# EAGLE design extension_board (EAGLE 6.5.0)

## Sheet 1 of 5: Header
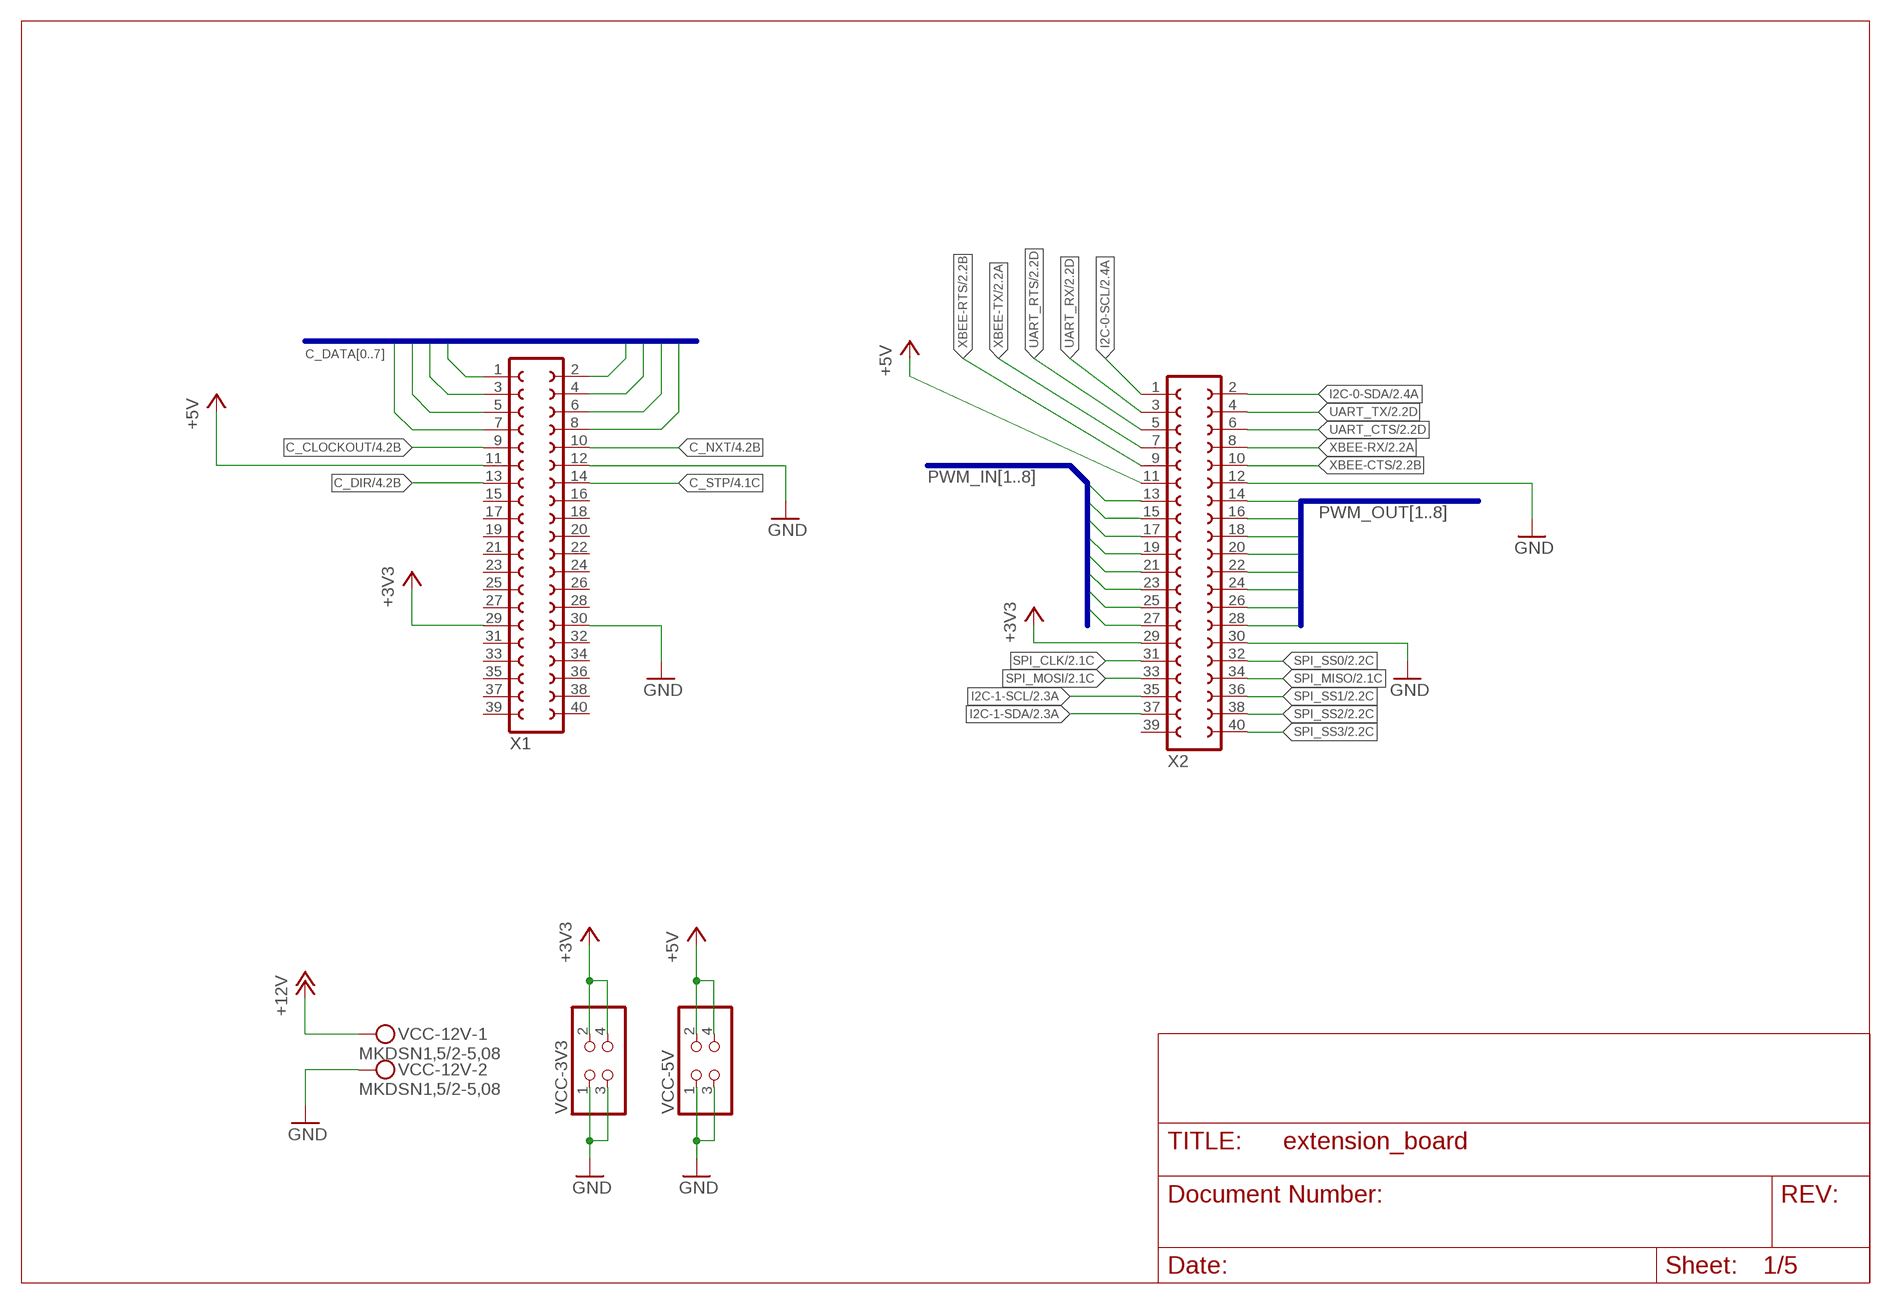
[diagram p0: schematic, sheet 1]

### Parts
VCC-3V3  PINHD-2X2  [2X02]
VCC-5V  PINHD-2X2  [2X02]
VCC-12V  MKDSN1,5/2-5,08  [MKDSN1,5/2-5,08]
X1  FE20-2  [FE20-2]
X2  FE20-2  [FE20-2]

### Nets
+3V3: VCC-3V3.2 VCC-3V3.4 X1.29 X2.29 ; also sheet 2,4,5
+5V: VCC-5V.2 VCC-5V.4 X1.11 X2.11 ; also sheet 2
+12V: VCC-12V.1 ; also sheet 3
C_CLOCKOUT: X1.9 ; also sheet 4
C_DATA0: X1.1 ; also sheet 4
C_DATA1: X1.3 ; also sheet 4
C_DATA2: X1.5 ; also sheet 4
C_DATA3: X1.7 ; also sheet 4
C_DATA4: X1.2 ; also sheet 4
C_DATA5: X1.4 ; also sheet 4
C_DATA6: X1.6 ; also sheet 4
C_DATA7: X1.8 ; also sheet 4
C_DIR: X1.13 ; also sheet 4
C_NXT: X1.10 ; also sheet 4
C_STP: X1.14 ; also sheet 4
GND: VCC-3V3.1 VCC-3V3.3 VCC-5V.1 VCC-5V.3 VCC-12V.2 X1.12 X1.30 X2.12 X2.30 ; also sheet 2,3,4,5
I2C-0-SCL: X2.1 ; also sheet 2
I2C-0-SDA: X2.2 ; also sheet 2
I2C-1-SCL: X2.35 ; also sheet 2
I2C-1-SDA: X2.37 ; also sheet 2
PWM_INPUT1: X2.13 ; also sheet 2
PWM_INPUT2: X2.15 ; also sheet 2
PWM_INPUT3: X2.17 ; also sheet 2
PWM_INPUT4: X2.19 ; also sheet 2
PWM_INPUT5: X2.21 ; also sheet 2
PWM_INPUT6: X2.23 ; also sheet 2
PWM_INPUT7: X2.25 ; also sheet 2
PWM_INPUT8: X2.27 ; also sheet 2
PWM_OUTPUT1: X2.28 ; also sheet 2
PWM_OUTPUT2: X2.26 ; also sheet 2
PWM_OUTPUT3: X2.24 ; also sheet 2
PWM_OUTPUT4: X2.22 ; also sheet 2
PWM_OUTPUT5: X2.20 ; also sheet 2
PWM_OUTPUT6: X2.18 ; also sheet 2
PWM_OUTPUT7: X2.16 ; also sheet 2
PWM_OUTPUT8: X2.14 ; also sheet 2
SPI_CLK: X2.31 ; also sheet 2
SPI_MISO: X2.34 ; also sheet 2
SPI_MOSI: X2.33 ; also sheet 2
SPI_SS0: X2.32 ; also sheet 2
SPI_SS1: X2.36 ; also sheet 2
SPI_SS2: X2.38 ; also sheet 2
SPI_SS3: X2.40 ; also sheet 2
UART_CTS: X2.6 ; also sheet 2
UART_RTS: X2.5 ; also sheet 2
UART_RX: X2.3 ; also sheet 2
UART_TX: X2.4 ; also sheet 2
XBEE-CTS: X2.10 ; also sheet 2
XBEE-RTS: X2.9 ; also sheet 2
XBEE-RX: X2.8 ; also sheet 2
XBEE-TX: X2.7 ; also sheet 2
Unconnected: X1.15 X1.16 X1.17 X1.18 X1.19 X1.20 X1.21 X1.22 X1.23 X1.24 X1.25 X1.26 X1.27 X1.28 X1.31 X1.32 X1.33 X1.34 X1.35 X1.36 X1.37 X1.38 X1.39 X1.40 X2.39

### Buses
PWM_IN[1..8]
PWM_OUT[1..8]
C_DATA[0..7]

## Sheet 2 of 5: Interfaces
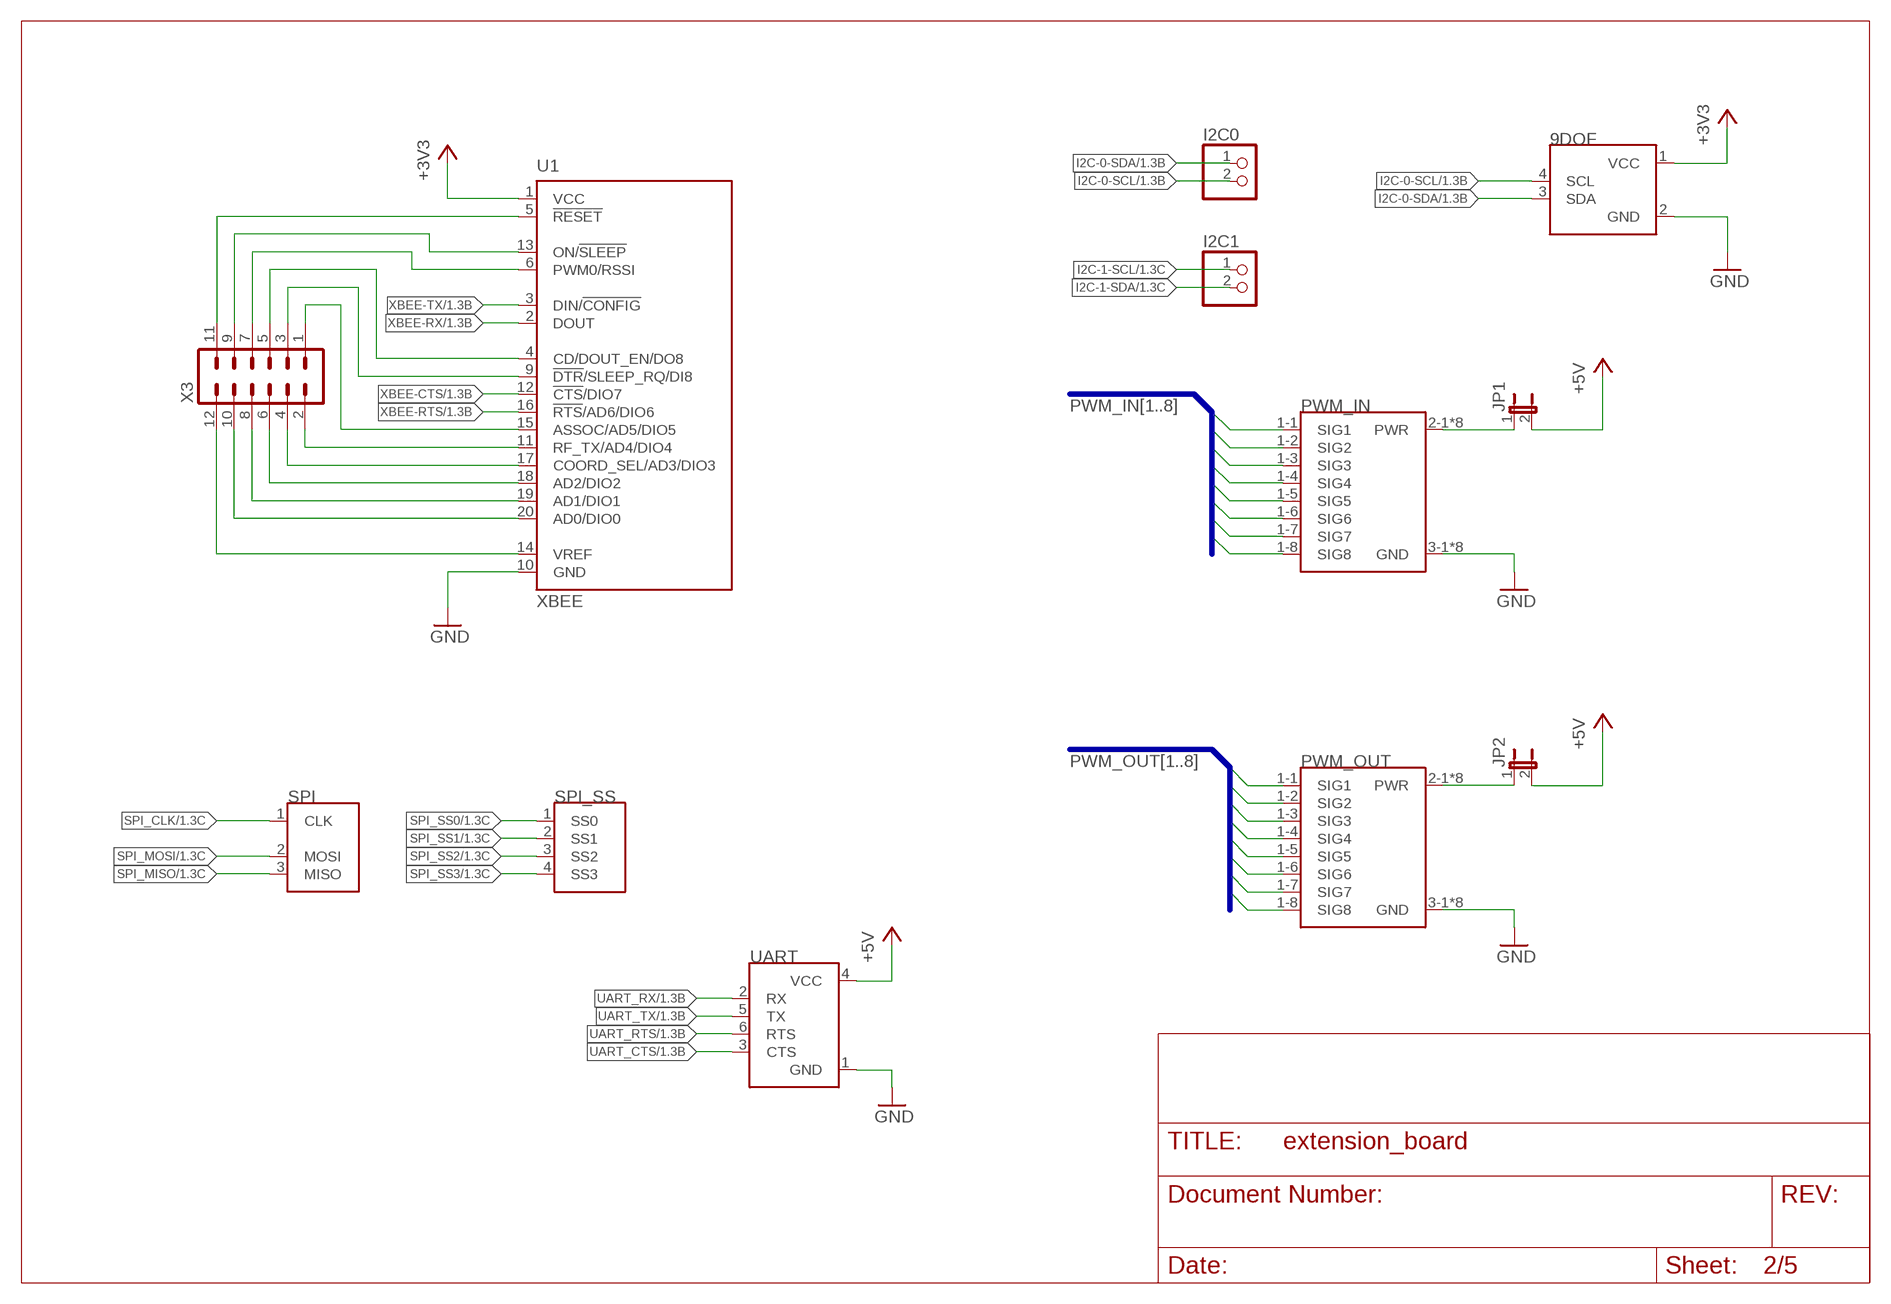
[diagram p1: schematic, sheet 2]

### Parts
9DOF  I2C  [MA04-1]
I2C0  PINHD-1X2  [1X02]
I2C1  PINHD-1X2  [1X02]
JP1  JP1E  [JP1]
JP2  JP1E  [JP1]
PWM_IN  8RX  [MA08-3]
PWM_OUT  8RX  [MA08-3]
SPI  SPI_MAIN  [MA03-1]
SPI_SS  SPI_SS  [MA04-1]
U1  XBEE  [XBEE]
UART  UART  [MA03-2]
X3  MA06-2  [MA06-2]

### Nets
+3V3: 9DOF.1(VCC) U1.1(VCC) ; also sheet 1,4,5
+5V: JP1.2 JP2.2 UART.4(VCC) ; also sheet 1
GND: 9DOF.2(GND) PWM_IN.3-1(GND) PWM_IN.3-2(GND) PWM_IN.3-3(GND) PWM_IN.3-4(GND) PWM_IN.3-5(GND) PWM_IN.3-6(GND) PWM_IN.3-7(GND) PWM_IN.3-8(GND) PWM_OUT.3-1(GND) PWM_OUT.3-2(GND) PWM_OUT.3-3(GND) PWM_OUT.3-4(GND) PWM_OUT.3-5(GND) PWM_OUT.3-6(GND) PWM_OUT.3-7(GND) PWM_OUT.3-8(GND) U1.10(GND) UART.1(GND) ; also sheet 1,3,4,5
I2C-0-SCL: 9DOF.4(SCL) I2C0.2 ; also sheet 1
I2C-0-SDA: 9DOF.3(SDA) I2C0.1 ; also sheet 1
I2C-1-SCL: I2C1.1 ; also sheet 1
I2C-1-SDA: I2C1.2 ; also sheet 1
N$11: JP1.1 PWM_IN.2-1(PWR) PWM_IN.2-2(PWR) PWM_IN.2-3(PWR) PWM_IN.2-4(PWR) PWM_IN.2-5(PWR) PWM_IN.2-6(PWR) PWM_IN.2-7(PWR) PWM_IN.2-8(PWR)
N$12: JP2.1 PWM_OUT.2-1(PWR) PWM_OUT.2-2(PWR) PWM_OUT.2-3(PWR) PWM_OUT.2-4(PWR) PWM_OUT.2-5(PWR) PWM_OUT.2-6(PWR) PWM_OUT.2-7(PWR) PWM_OUT.2-8(PWR)
N$23: U1.5(!RESET) X3.11
N$24: U1.14(VREF) X3.12
N$25: U1.20(AD0/DIO0) X3.10
N$26: U1.19(AD1/DIO1) X3.8
N$27: U1.18(AD2/DIO2) X3.6
N$28: U1.17(COORD_SEL/AD3/DIO3) X3.4
N$29: U1.11(RF_TX/AD4/DIO4) X3.2
N$30: U1.15(ASSOC/AD5/DIO5) X3.1
N$31: U1.9(!DTR!/SLEEP_RQ/DI8) X3.3
N$32: U1.4(CD/DOUT_EN/DO8) X3.5
N$33: U1.6(PWM0/RSSI) X3.7
N$34: U1.13(ON/!SLEEP) X3.9
PWM_INPUT1: PWM_IN.1-1(SIG1) ; also sheet 1
PWM_INPUT2: PWM_IN.1-2(SIG2) ; also sheet 1
PWM_INPUT3: PWM_IN.1-3(SIG3) ; also sheet 1
PWM_INPUT4: PWM_IN.1-4(SIG4) ; also sheet 1
PWM_INPUT5: PWM_IN.1-5(SIG5) ; also sheet 1
PWM_INPUT6: PWM_IN.1-6(SIG6) ; also sheet 1
PWM_INPUT7: PWM_IN.1-7(SIG7) ; also sheet 1
PWM_INPUT8: PWM_IN.1-8(SIG8) ; also sheet 1
PWM_OUTPUT1: PWM_OUT.1-1(SIG1) ; also sheet 1
PWM_OUTPUT2: PWM_OUT.1-2(SIG2) ; also sheet 1
PWM_OUTPUT3: PWM_OUT.1-3(SIG3) ; also sheet 1
PWM_OUTPUT4: PWM_OUT.1-4(SIG4) ; also sheet 1
PWM_OUTPUT5: PWM_OUT.1-5(SIG5) ; also sheet 1
PWM_OUTPUT6: PWM_OUT.1-6(SIG6) ; also sheet 1
PWM_OUTPUT7: PWM_OUT.1-7(SIG7) ; also sheet 1
PWM_OUTPUT8: PWM_OUT.1-8(SIG8) ; also sheet 1
SPI_CLK: SPI.1(CLK) ; also sheet 1
SPI_MISO: SPI.3(MISO) ; also sheet 1
SPI_MOSI: SPI.2(MOSI) ; also sheet 1
SPI_SS0: SPI_SS.1(SS0) ; also sheet 1
SPI_SS1: SPI_SS.2(SS1) ; also sheet 1
SPI_SS2: SPI_SS.3(SS2) ; also sheet 1
SPI_SS3: SPI_SS.4(SS3) ; also sheet 1
UART_CTS: UART.3(CTS) ; also sheet 1
UART_RTS: UART.6(RTS) ; also sheet 1
UART_RX: UART.2(RX) ; also sheet 1
UART_TX: UART.5(TX) ; also sheet 1
XBEE-CTS: U1.12(!CTS!/DIO7) ; also sheet 1
XBEE-RTS: U1.16(!RTS!/AD6/DIO6) ; also sheet 1
XBEE-RX: U1.2(DOUT) ; also sheet 1
XBEE-TX: U1.3(DIN/!CONFIG) ; also sheet 1

### Buses
PWM_IN[1..8]
PWM_OUT[1..8]

## Sheet 3 of 5: power supply
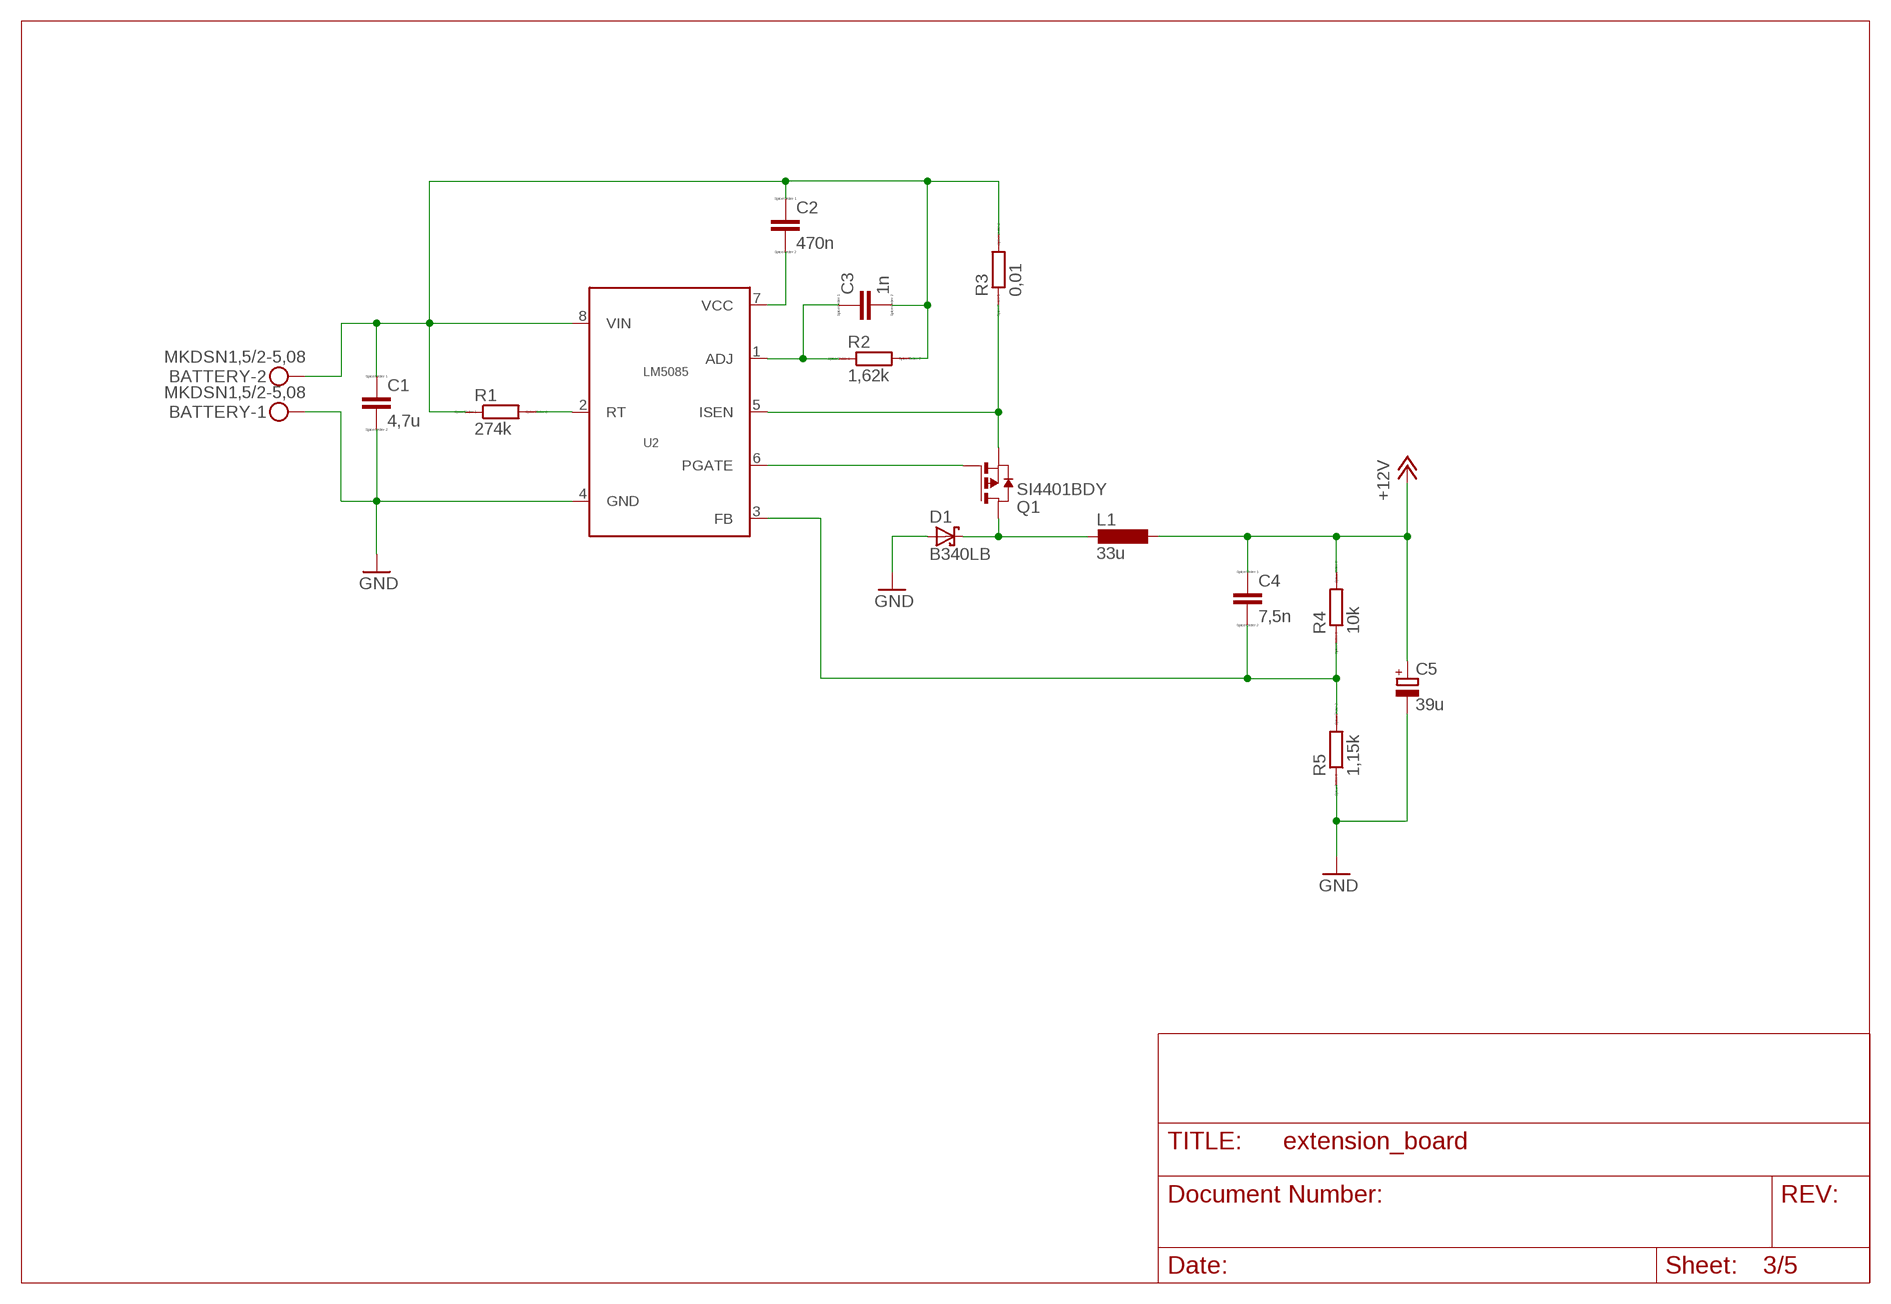
[diagram p2: schematic, sheet 3]

### Parts
BATTERY  MKDSN1,5/2-5,08  [MKDSN1,5/2-5,08]
C1  4,7u  CC1206  [C1206]
C2  470n  CC1206  [C1206]
C3  1n  CC1206  [C1206]
C4  7,5n  CC1206  [C1206]
C5  39u  CPOL-EUSMCB  [SMC_B]
D1  B340LB  [SMB]
L1  33u  MSS1210  [INDUKTOR]
Q1  SI4401BDY  [SO8-FET]
R1  274k  RR1206  [R1206]
R2  1,62k  RR1206  [R1206]
R3  0,01  RR1206  [R1206]
R4  10k  RR1206  [R1206]
R5  1,15k  RR1206  [R1206]
U2  LM5085  [S-PDSO-G08]

### Nets
+12V: C4.1 C5.+ L1.P$2 R4.2 ; also sheet 1
GND: BATTERY.1 C1.2 C5.- D1.A R5.1 U2.4(GND) ; also sheet 1,2,4,5
N$3: R1.2 U2.2(RT)
N$4: C2.2 U2.7(VCC)
N$5: C3.1 R2.1 U2.1(ADJ)
N$6: BATTERY.2 C1.1 C2.1 C3.2 R1.1 R2.2 R3.2 U2.8(VIN)
N$7: Q1.1(S) Q1.2(S) Q1.3(S) R3.1 U2.5(ISEN)
N$8: C4.2 R4.1 R5.2 U2.3(FB)
N$9: Q1.4(G) U2.6(PGATE)
N$10: D1.C L1.P$1 Q1.5(D) Q1.6(D) Q1.7(D) Q1.8(D) Q1.D1(D) Q1.D2(D) Q1.D3(D)

## Sheet 4 of 5: USB Controller
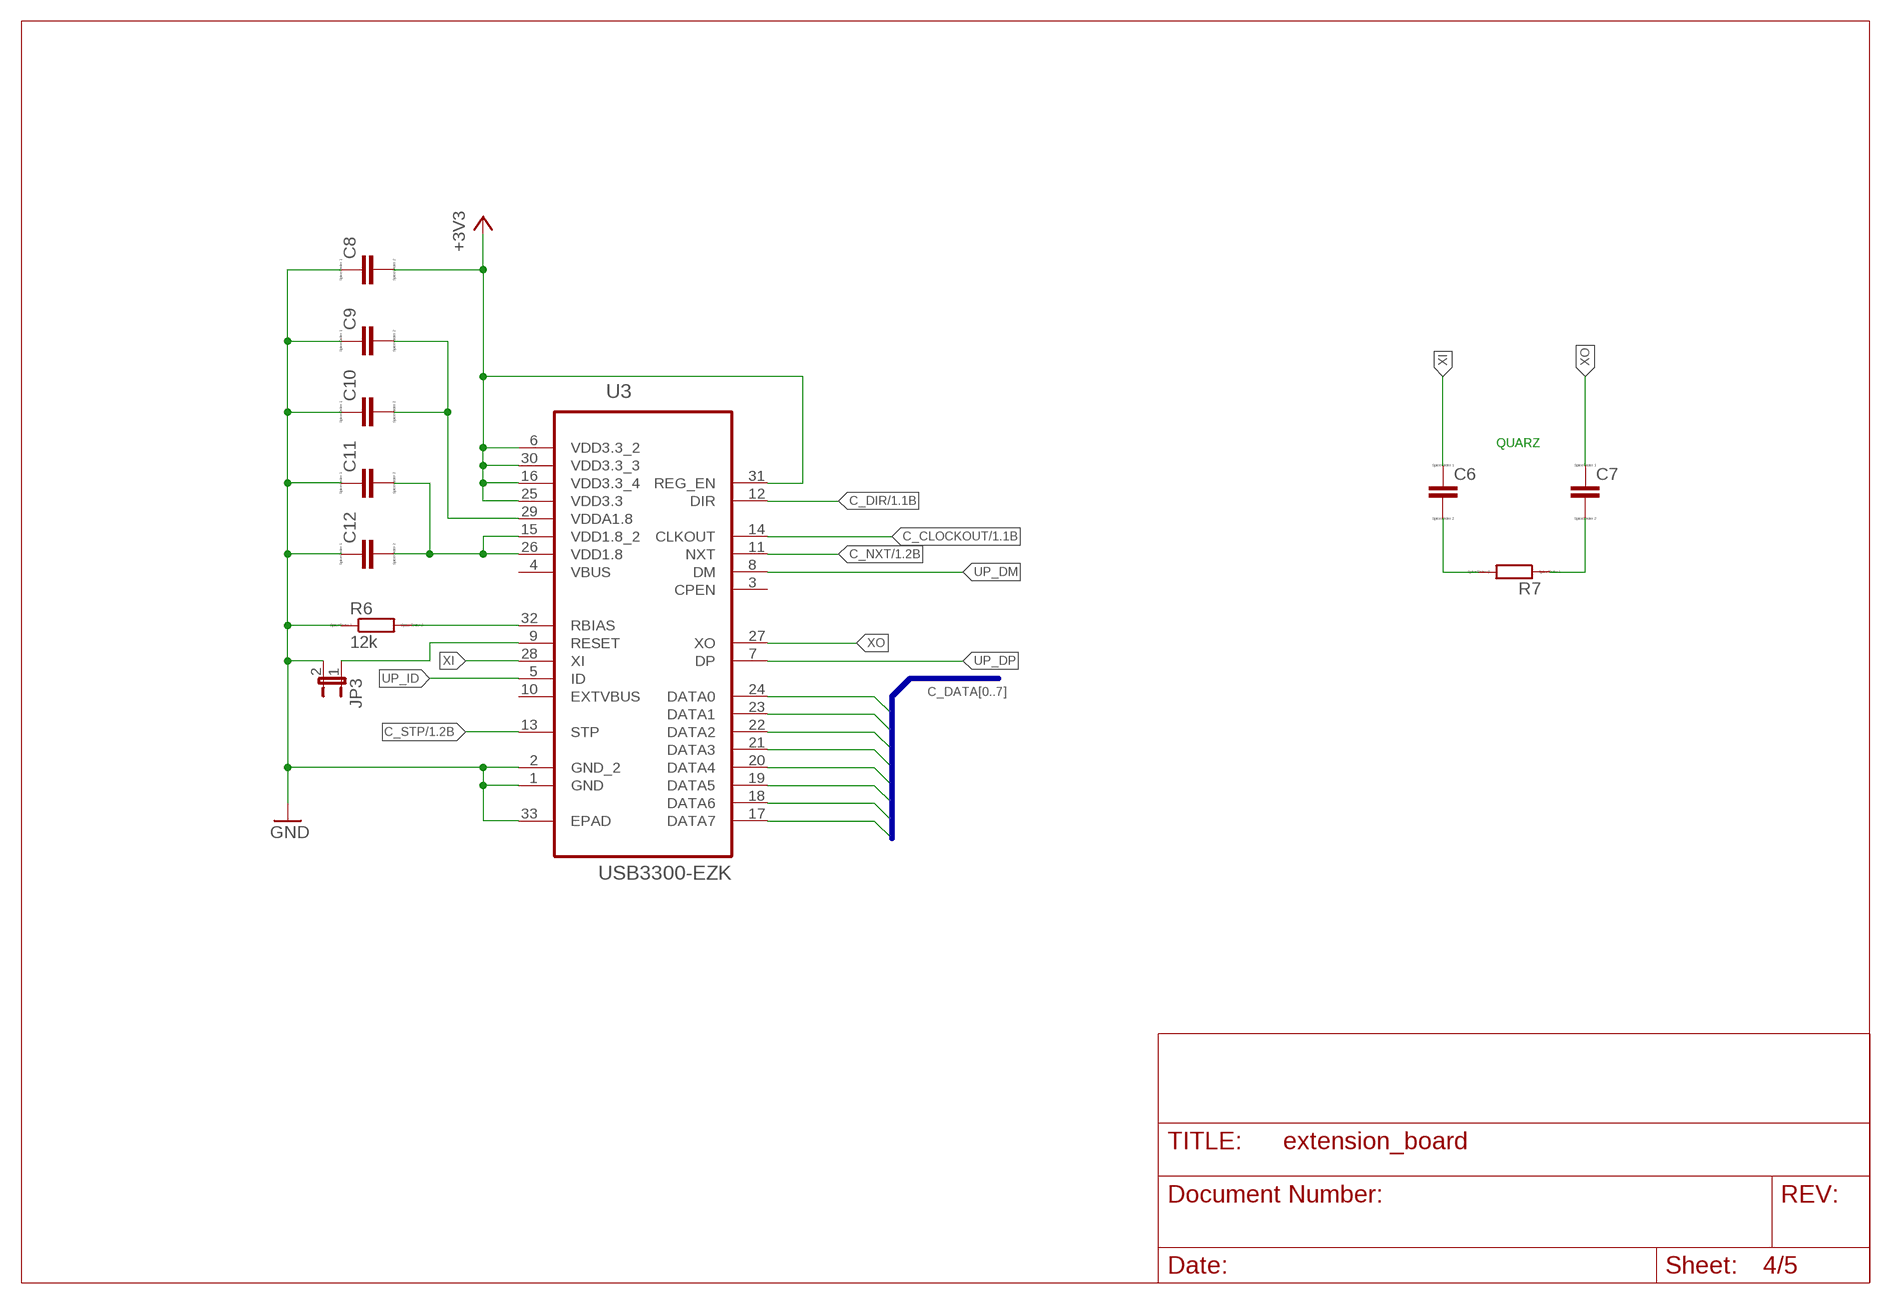
[diagram p3: schematic, sheet 4]

### Parts
C6  CC1206  [C1206]
C7  CC1206  [C1206]
C8  CC1206  [C1206]
C9  CC1206  [C1206]
C10  CC1206  [C1206]
C11  CC1206  [C1206]
C12  CC1206  [C1206]
JP3  JP1E  [JP1]
R6  12k  RR1206  [R1206]
R7  RR1206  [R1206]
U3  USB3300-EZK  [QFN50P500X500X100-33N]

### Nets
+3V3: C8.2 U3.6(VDD3.3_2) U3.16(VDD3.3_4) U3.25(VDD3.3) U3.30(VDD3.3_3) U3.31(REG_EN) ; also sheet 1,2,5
C_CLOCKOUT: U3.14(CLKOUT) ; also sheet 1
C_DATA0: U3.24(DATA0) ; also sheet 1
C_DATA1: U3.23(DATA1) ; also sheet 1
C_DATA2: U3.22(DATA2) ; also sheet 1
C_DATA3: U3.21(DATA3) ; also sheet 1
C_DATA4: U3.20(DATA4) ; also sheet 1
C_DATA5: U3.19(DATA5) ; also sheet 1
C_DATA6: U3.18(DATA6) ; also sheet 1
C_DATA7: U3.17(DATA7) ; also sheet 1
C_DIR: U3.12(DIR) ; also sheet 1
C_NXT: U3.11(NXT) ; also sheet 1
C_STP: U3.13(STP) ; also sheet 1
GND: C8.1 C9.1 C10.1 C11.1 C12.1 JP3.2 R6.1 U3.1(GND) U3.2(GND_2) U3.33(EPAD) ; also sheet 1,2,3,5
N$1: C9.2 C10.2 U3.29(VDDA1.8)
N$2: R6.2 U3.32(RBIAS)
N$13: C6.2 R7.2
N$14: C7.2 R7.1
N$15: C11.2 C12.2 U3.15(VDD1.8_2) U3.26(VDD1.8)
N$16: JP3.1 U3.9(RESET)
UP_DM: U3.8(DM)
UP_DP: U3.7(DP)
UP_ID: U3.5(ID)
XI: C6.1 U3.28(XI)
XO: C7.1 U3.27(XO)
Unconnected: U3.3(CPEN) U3.10(EXTVBUS)

### Buses
C_DATA[0..7]

### Notes on the sheet
- QUARZ

## Sheet 5 of 5: USB Hub
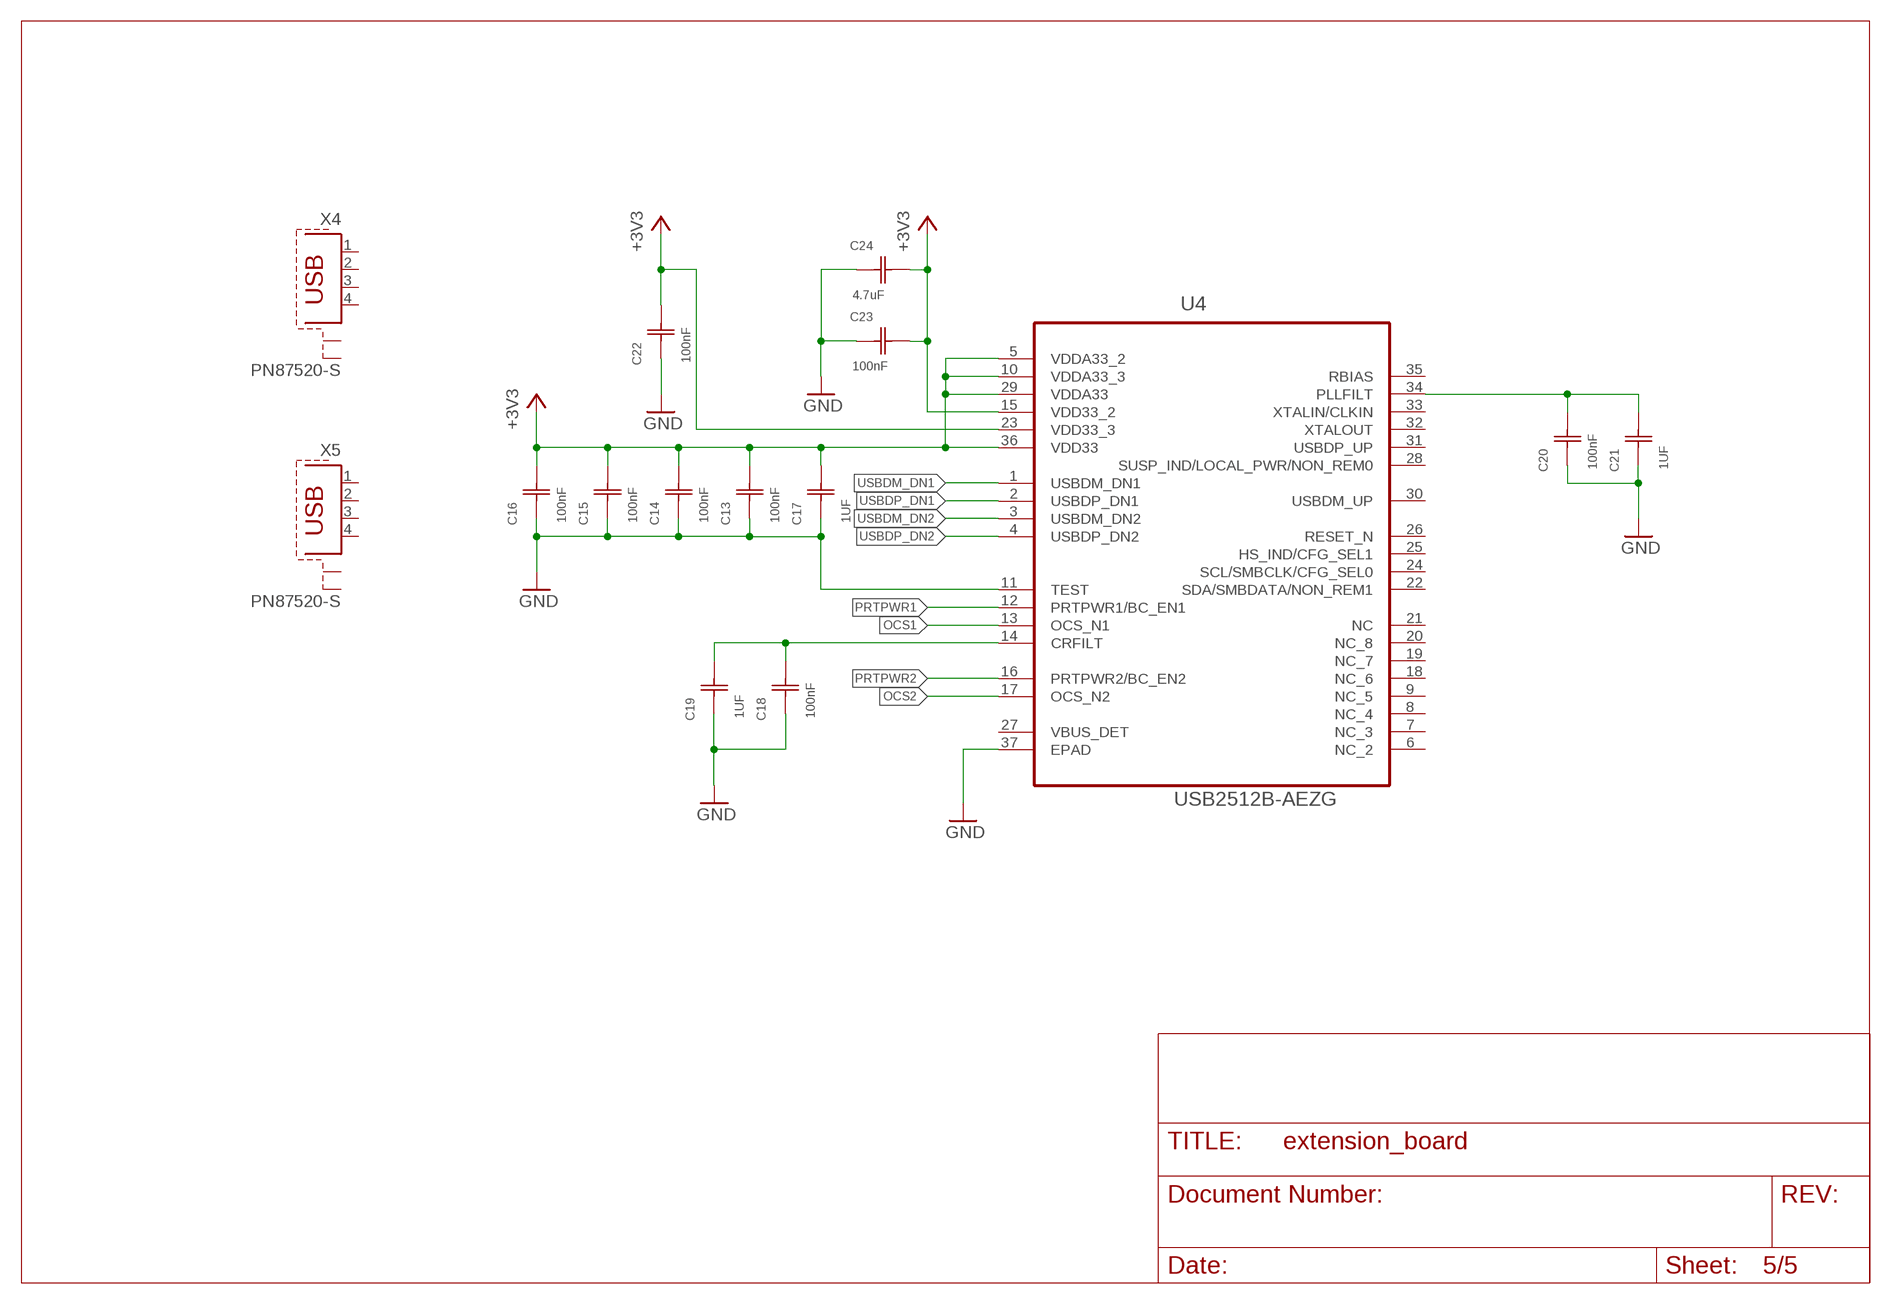
[diagram p4: schematic, sheet 5]

### Parts
C13  100nF  06033C104JAT2A  [CAPC1608X90N]
C14  100nF  06033C104JAT2A  [CAPC1608X90N]
C15  100nF  06033C104JAT2A  [CAPC1608X90N]
C16  100nF  06033C104JAT2A  [CAPC1608X90N]
C17  1UF  1206YC105KAT2A  [CAPC3216X127N]
C18  100nF  06033C104JAT2A  [CAPC1608X90N]
C19  1UF  1206YC105KAT2A  [CAPC3216X127N]
C20  100nF  06033C104JAT2A  [CAPC1608X90N]
C21  1UF  1206YC105KAT2A  [CAPC3216X127N]
C22  100nF  06033C104JAT2A  [CAPC1608X90N]
C23  100nF  06033C104JAT2A  [CAPC1608X90N]
C24  4.7uF  08053D475KAT2A  [CAPC2013X140N]
U4  USB2512B-AEZG  [QFN50P600X600X100-37N]
X4  PN87520-S  [PN87520-S]
X5  PN87520-S  [PN87520-S]

### Nets
+3V3: C13.2(C2) C14.2(C2) C15.2(C2) C16.2(C2) C17.2(C2) C22.2(C2) C23.2(C2) C24.2(C2) U4.5(VDDA33_2) U4.10(VDDA33_3) U4.15(VDD33_2) U4.23(VDD33_3) U4.29(VDDA33) U4.36(VDD33) ; also sheet 1,2,4
GND: C13.1(C1) C14.1(C1) C15.1(C1) C16.1(C1) C17.1(C1) C18.1(C1) C19.1(C1) C20.1(C1) C21.1(C1) C22.1(C1) C23.1(C1) C24.1(C1) U4.11(TEST) U4.37(EPAD) ; also sheet 1,2,3,4
N$18: C18.2(C2) C19.2(C2) U4.14(CRFILT)
N$21: C20.2(C2) C21.2(C2) U4.34(PLLFILT)
OCS1: U4.13(OCS_N1)
OCS2: U4.17(OCS_N2)
PRTPWR1: U4.12(PRTPWR1/BC_EN1)
PRTPWR2: U4.16(PRTPWR2/BC_EN2)
USBDM_DN1: U4.1(USBDM_DN1)
USBDM_DN2: U4.3(USBDM_DN2)
USBDP_DN1: U4.2(USBDP_DN1)
USBDP_DN2: U4.4(USBDP_DN2)
Unconnected: U4.6(NC_2) U4.7(NC_3) U4.8(NC_4) U4.9(NC_5) U4.18(NC_6) U4.19(NC_7) U4.20(NC_8) U4.21(NC) U4.22(SDA/SMBDATA/NON_REM1) U4.24(SCL/SMBCLK/CFG_SEL0) U4.25(HS_IND/CFG_SEL1) U4.26(RESET_N) U4.28(SUSP_IND/LOCAL_PWR/NON_REM0) U4.30(USBDM_UP) U4.31(USBDP_UP) U4.32(XTALOUT) U4.33(XTALIN/CLKIN) U4.35(RBIAS) X4.1 X4.2 X4.3 X4.4 X4.S1 X4.S2 X5.1 X5.2 X5.3 X5.4 X5.S1 X5.S2

## Power pins joined to a net without a drawn wire
VBUS: U3.4(VBUS)
VBUS_DET: U4.27(VBUS_DET)

## Library data of the parts
9DOF = multicopter:I2C
BATTERY VCC-12V = con-phoenix-508:MKDSN1,5/2-5,08: MKDSN 1,5/ 2-5,08 Printklemme Nennstrom: 13,5 A Nennspannung: 250 V Rastermaß: 5,08 mm Polzahl: 2 Anschlussart: Schraubanschluss Montage: Löten Anschlussrichtung Leiter/Platine: 0 ° Artikelnummer: 1729128 Source: http://eshop.phoenixcontact.com .. 1729128.pdf; MPN: MKDSN 1,5/2-5.08; OC_FARNELL: 1792903; OC_NEWARK: 30M2397
C1-C4 C6-C12 = eagle-ltspice:C: CAPACITOR, European symbol; SPICEMODEL: NONE; SPICEPREFIX: C
C5 = resistor:CPOL-EU: POLARIZED CAPACITOR, European symbol
C13-C16 C18 C20 C22 C23 = kondensator:06033C104JAT2A: Capacitor 0603; MPN: 06033C104JAT2A; OC_FARNELL: 1740614; OC_NEWARK: 60R6215; SUPPLIER: AVX; TOLERANCE: ±5%; VOLTAGERATING: 25V
C17 C19 C21 = kondensator:1206YC105KAT2A; DESCRIPTION: Capacitor 1206; MPN: 1206YC105KAT2A; OC_FARNELL: 499717; OC_NEWARK: 25C3294; SUPPLIER: AVX; TOLERANCE: ±10%; VOLTAGERATING: 16V
C24 = kondensator:08053D475KAT2A: Capacitor 0805; MPN: 08053D475KAT2A; OC_FARNELL: 1657932; OC_NEWARK: 27M3797; SUPPLIER: AVX; TOLERANCE: ±10%; VOLTAGERATING: 25V
D1 = multicopter:B340L: Silicon Schottky Diodes General-purpose diode for high-speed switching
I2C0 I2C1 = pinhead:PINHD-1X2: PIN HEADER
JP1-JP3 = jumper:JP1E: JUMPER
L1 = multicopter:MSS1210
PWM_IN PWM_OUT = multicopter:8RX
Q1 = probox-parts:SI4401BDY
R1-R7 = eagle-ltspice:R: RESISTOR, European symbol; SPICEMODEL: NONE; SPICEPREFIX: R
SPI = multicopter:SPI_MAIN
SPI_SS = multicopter:SPI_SS
U1 = maxstream:XBEE: XBee (TM) /XBee-PRO(TM) OEM RF Modules Source: MaxStream, Inc. xbee_productmanual.pdf; MPN: XBP24-Z7UIT-004; OC_FARNELL: 1751799; OC_NEWARK: 34R5507
U2 = multicopter:LM5085: LM5085 http://www.ti.com/lit/ds/symlink/lm5085.pdf
U3 = usb3300:USB3300-EZK: IC, USB 2.0 ULPI PHY W/OTG, 32VQFN; MPN: USB3300-EZK; OC_FARNELL: 2292614; OC_NEWARK: 66W2142; PACKAGE: 32VQFN; SUPPLIER: Microchip
U4 = usb3300:USB2512B-AEZG: IC, 2-PORT USB 2.0 HUB CONTRL, 36VQFN; MPN: USB2512B-AEZG; OC_FARNELL: 2292602; OC_NEWARK: 66W2135; PACKAGE: 36VQFN; SUPPLIER: Microchip
UART = multicopter:UART
VCC-3V3 VCC-5V = pinhead:PINHD-2X2: PIN HEADER
X1 X2 = con-lsta:FE20-2: FEMALE HEADER; OC_FARNELL: unknown; OC_NEWARK: unknown
X3 = con-lstb:MA06-2: PIN HEADER; OC_FARNELL: unknown; OC_NEWARK: unknown
X4 X5 = con-berg:PN87520-S; OC_FARNELL: unknown; OC_NEWARK: unknown

## Board
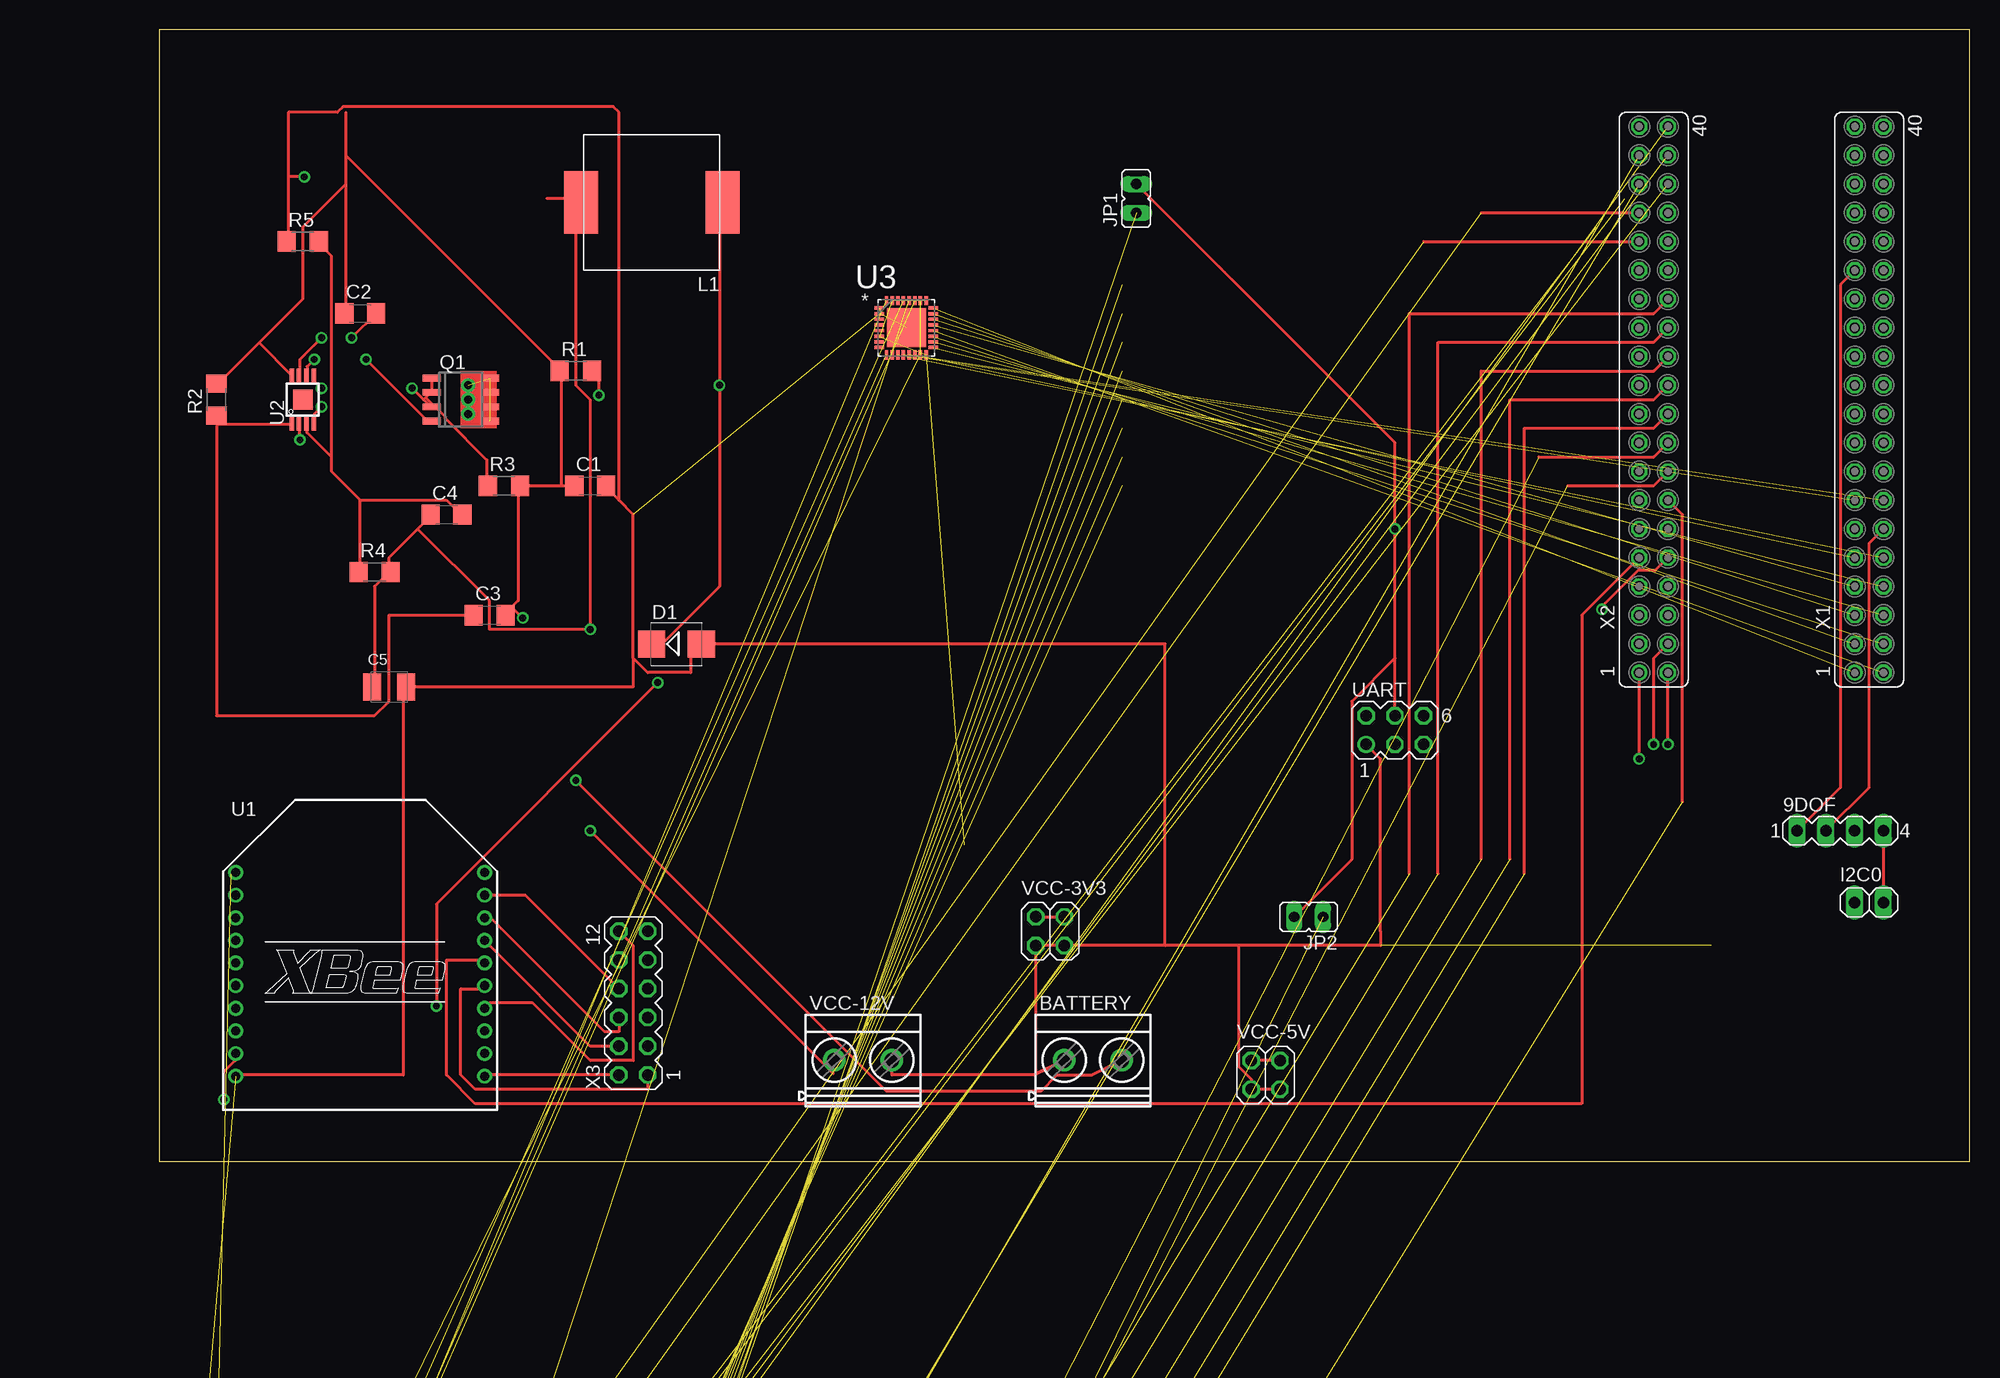
[diagram p5: board, top side]
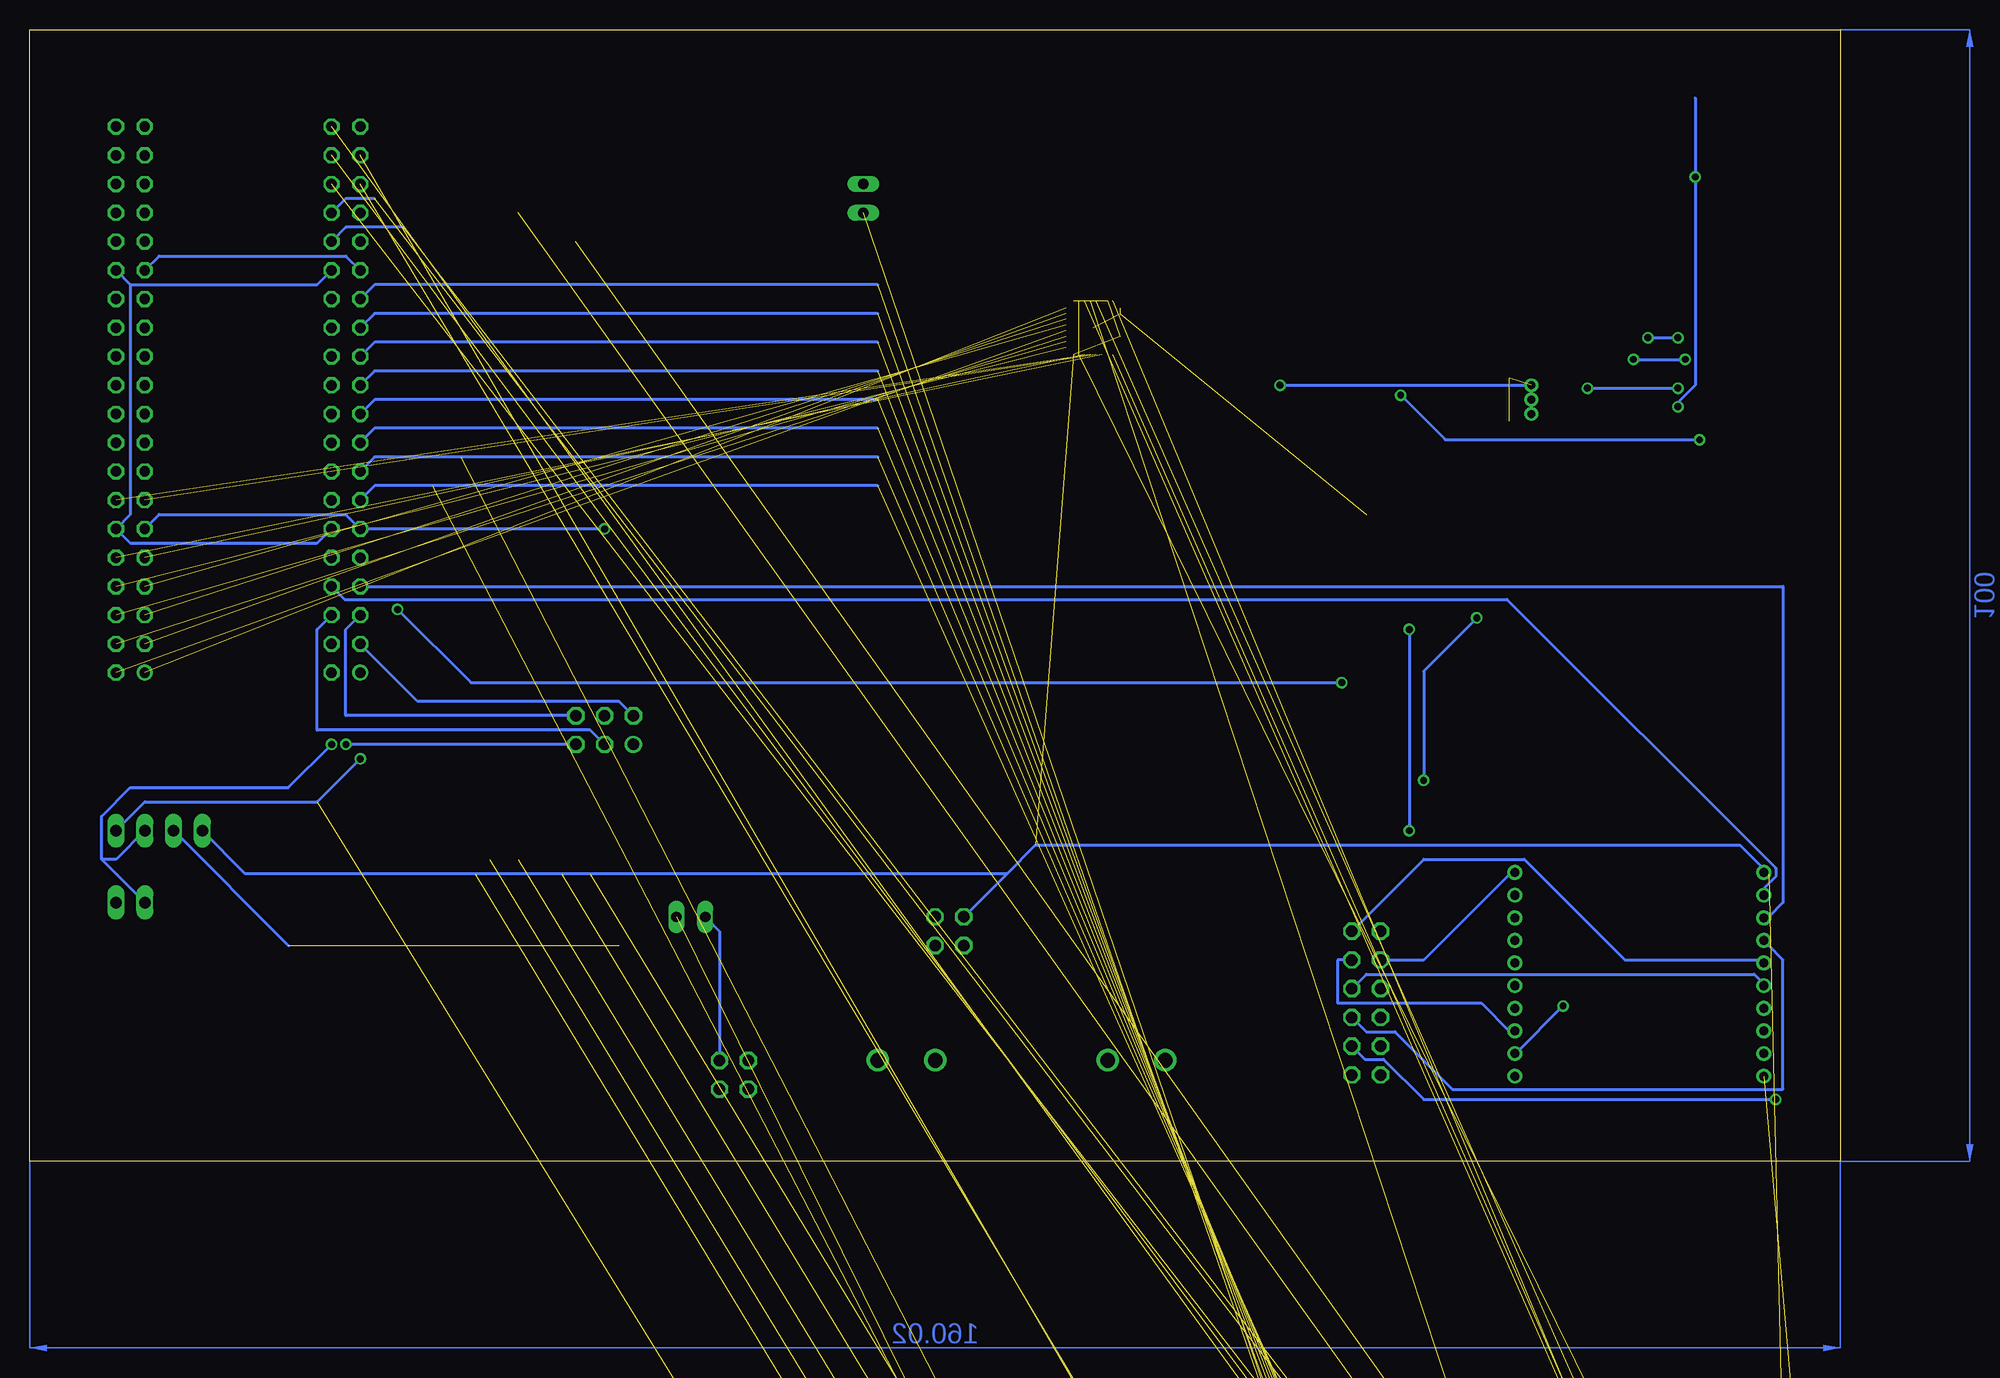
[diagram p6: board, bottom side, seen from below]

Size 160 x 100 mm. Coordinates in mm from the lower left corner, seen from the top.
Outline: 0,0 160,0 160,100 0,100 0,0
Copper layers (1*16): Top 0.035mm / dielectric 1.5mm / Bottom 0.035mm
Design rules "default": minimum track width 10mil, minimum drill 24mil, track to track 8mil, track to pad 8mil, pad to pad 8mil, via to via 8mil, smd to smd 8mil, copper to edge 40mil, drill to drill 8mil, minimum pad ring 10mil, minimum via ring 8mil, stop-mask expansion 4mil, vias tented up to drill 0mil, thermal gap 10mil

### Footprints (pad centres in the part's own frame; a part is rotated, then mirrored left to right if it is on the bottom)
MA04-1 = drill 1.016 long: 1 -3.81,0; 2 -1.27,0; 3 1.27,0; 4 3.81,0
MKDSN1,5/2-5,08 = drill 1.3 pad 2: 1 -2.561,0.025; 2 2.519,0.025
C1206 = smd 1.6 x 1.8: 1 -1.4,0; 2 1.4,0
SMC_B = smd 1.6 x 2.4: + -1.5,0; - 1.5,0
CAPC1608X90N = smd 0.66 x 0.94: 1 -0.711,0; 2 0.711,0
CAPC3216X127N = smd 1.118 x 1.803: 1 -1.499,0; 2 1.499,0
CAPC2013X140N = smd 0.914 x 1.448: 1 -0.813,0; 2 0.813,0
SMB = smd 2.4 x 2.4: A 2.2,0; C -2.2,0
1X02 = drill 1.016 long: 1 -1.27,0; 2 1.27,0
JP1 = drill 0.914 long: 1 0,-1.27; 2 0,1.27
INDUKTOR = smd 5.5 x 3: P$1 6,-0.25; P$2 6,12.25
MA08-3 = drill 1.016 octagon: 1-1 -8.89,5.08; 1-2 -6.35,5.08; 1-3 -3.81,5.08; 1-4 -1.27,5.08; 1-5 1.27,5.08; 1-6 3.81,5.08; 1-7 6.35,5.08; 1-8 8.89,5.08; 2-1 -8.89,2.54; 2-2 -6.35,2.54; 2-3 -3.81,2.54; 2-4 -1.27,2.54; 2-5 1.27,2.54; 2-6 3.81,2.54; 2-7 6.35,2.54; 2-8 8.89,2.54; 3-1 -8.89,0; 3-2 -6.35,0; 3-3 -3.81,0; 3-4 -1.27,0; 3-5 1.27,0; 3-6 3.81,0; 3-7 6.35,0; 3-8 8.89,0
SO8-FET = smd 0.6 x 1.6: 1 -1.905,-2.6; 2 -0.635,-2.6; 3 0.635,-2.6; 4 1.905,-2.6; 5 1.905,2.6; 6 0.635,2.6; 7 -0.635,2.6; 8 -1.905,2.6 | drill 0.7: D1 -1.27,0.635; D2 0,0.635; D3 1.27,0.635
R1206 = smd 1.6 x 1.803: 1 -1.422,0; 2 1.422,0
MA03-1 = drill 1.016 long: 1 -2.54,0; 2 0,0; 3 2.54,0
XBEE = drill 0.8 pad 1.27: 1 -11,9; 2 -11,7; 3 -11,5; 4 -11,3; 5 -11,1; 6 -11,-1; 7 -11,-3; 8 -11,-5; 9 -11,-7; 10 -11,-9; 11 11,-9; 12 11,-7; 13 11,-5; 14 11,-3; 15 11,-1; 16 11,1; 17 11,3; 18 11,5; 19 11,7; 20 11,9
S-PDSO-G08 = smd 0.4 x 1.2: 1 -0.975,-2.157; 2 -0.325,-2.157; 3 0.325,-2.157; 4 0.975,-2.157; 5 0.975,2.157; 6 0.325,2.157; 7 -0.325,2.157; 8 -0.975,2.157 | smd 1.73 x 1.78: TH 0,0
QFN50P500X500X100-33N = smd 0.813 x 0.305: 1 -2.388,1.753; 2 -2.388,1.245; 3 -2.388,0.762; 4 -2.388,0.254; 5 -2.388,-0.254; 6 -2.388,-0.762; 7 -2.388,-1.245; 8 -2.388,-1.753; 17 2.388,-1.753; 18 2.388,-1.245; 19 2.388,-0.762; 20 2.388,-0.254; 21 2.388,0.254; 22 2.388,0.762; 23 2.388,1.245; 24 2.388,1.753 | smd 0.305 x 0.813: 9 -1.753,-2.388; 10 -1.245,-2.388; 11 -0.762,-2.388; 12 -0.254,-2.388; 13 0.254,-2.388; 14 0.762,-2.388; 15 1.245,-2.388; 16 1.753,-2.388; 25 1.753,2.388; 26 1.245,2.388; 27 0.762,2.388; 28 0.254,2.388; 29 -0.254,2.388; 30 -0.762,2.388; 31 -1.245,2.388; 32 -1.753,2.388 | smd 3.454 x 3.454: 33 0,0
QFN50P600X600X100-37N = smd 1.016 x 0.305: 1 -2.921,2.007; 2 -2.921,1.499; 3 -2.921,0.991; 4 -2.921,0.508; 5 -2.921,0; 6 -2.921,-0.508; 7 -2.921,-0.991; 8 -2.921,-1.499; 9 -2.921,-2.007; 19 2.921,-2.007; 20 2.921,-1.499; 21 2.921,-0.991; 22 2.921,-0.508; 23 2.921,0; 24 2.921,0.508; 25 2.921,0.991; 26 2.921,1.499; 27 2.921,2.007 | smd 0.305 x 1.016: 10 -2.007,-2.921; 11 -1.499,-2.921; 12 -0.991,-2.921; 13 -0.508,-2.921; 14 0,-2.921; 15 0.508,-2.921; 16 0.991,-2.921; 17 1.499,-2.921; 18 2.007,-2.921; 28 2.007,2.921; 29 1.499,2.921; 30 0.991,2.921; 31 0.508,2.921; 32 0,2.921; 33 -0.508,2.921; 34 -0.991,2.921; 35 -1.499,2.921; 36 -2.007,2.921 | smd 3.708 x 3.708: 37 0,0
MA03-2 = drill 1.016: 1 -2.54,-1.27 | drill 1.016 octagon: 2 -2.54,1.27; 3 0,-1.27; 4 0,1.27; 5 2.54,-1.27; 6 2.54,1.27
2X02 = drill 1.016 octagon: 1 -1.27,-1.27; 2 -1.27,1.27; 3 1.27,-1.27; 4 1.27,1.27
FE20-2 = drill 0.914: 1 -24.13,1.27 | drill 0.914 octagon: 2 -24.13,-1.27; 3 -21.59,1.27; 4 -21.59,-1.27; 5 -19.05,1.27; 6 -19.05,-1.27; 7 -16.51,1.27; 8 -16.51,-1.27; 9 -13.97,1.27; 10 -13.97,-1.27; 11 -11.43,1.27; 12 -11.43,-1.27; 13 -8.89,1.27; 14 -8.89,-1.27; 15 -6.35,1.27; 16 -6.35,-1.27; 17 -3.81,1.27; 18 -3.81,-1.27; 19 -1.27,1.27; 20 -1.27,-1.27; 21 1.27,1.27; 22 1.27,-1.27; 23 3.81,1.27; 24 3.81,-1.27; 25 6.35,1.27; 26 6.35,-1.27; 27 8.89,1.27; 28 8.89,-1.27; 29 11.43,1.27; 30 11.43,-1.27; 31 13.97,1.27; 32 13.97,-1.27; 33 16.51,1.27; 34 16.51,-1.27; 35 19.05,1.27; 36 19.05,-1.27; 37 21.59,1.27; 38 21.59,-1.27; 39 24.13,1.27; 40 24.13,-1.27
MA06-2 = drill 1.016 octagon: 1 -6.35,-1.27; 2 -6.35,1.27; 3 -3.81,-1.27; 4 -3.81,1.27; 5 -1.27,-1.27; 6 -1.27,1.27; 7 1.27,-1.27; 8 1.27,1.27; 9 3.81,-1.27; 10 3.81,1.27; 11 6.35,-1.27; 12 6.35,1.27
PN87520-S = drill 0.95 long: 1 -3.5,2.71; 2 -1,2.71; 3 1,2.71; 4 3.5,2.71 | drill 2.3 pad 2.9: S1 -6.57,0; S2 6.57,0

### Placement (x,y rotation side)
9DOF  148.59,29.21 0 top
BATTERY  82.55,8.89 0 top
C1  38.1,59.69 0 top
C2  17.78,74.93 0 top
C3  29.21,48.26 0 top
C4  25.4,57.15 0 top
C5  20.32,41.91 0 top
C6  27.94,-44.45 0 top  (outside the outline)
C7  15.24,-44.45 0 top  (outside the outline)
C8  2.54,-74.93 0 top  (outside the outline)
C9  2.54,-85.09 0 top  (outside the outline)
C10  2.54,-63.5 0 top  (outside the outline)
C11  2.54,-57.15 0 top  (outside the outline)
C12  2.54,-80.01 0 top  (outside the outline)
C13  -22.86,-207.01 0 top  (outside the outline)
C14  -22.86,-215.9 0 top  (outside the outline)
C15  -22.86,-224.79 0 top  (outside the outline)
C16  -22.86,-233.68 0 top  (outside the outline)
C17  -21.59,-240.03 0 top  (outside the outline)
C18  -22.86,-246.38 0 top  (outside the outline)
C19  -21.59,-252.73 0 top  (outside the outline)
C20  -22.86,-259.08 0 top  (outside the outline)
C21  -21.59,-265.43 0 top  (outside the outline)
C22  -22.86,-271.78 0 top  (outside the outline)
C23  -22.86,-278.13 0 top  (outside the outline)
C24  -24.13,-284.48 0 top  (outside the outline)
D1  45.72,45.72 0 top
I2C0  151.13,22.86 0 top
I2C1  -24.13,-175.26 0 top  (outside the outline)
JP1  86.36,85.09 0 top
JP2  101.6,21.59 90 top
JP3  -3.81,-82.55 0 top  (outside the outline)
L1  49.53,78.74 90 top
PWM_IN  -13.97,-186.69 0 top  (outside the outline)
PWM_OUT  -13.97,-199.39 0 top  (outside the outline)
Q1  26.67,67.31 270 top
R1  36.83,69.85 0 top
R2  5.08,67.31 90 top
R3  30.48,59.69 0 top
R4  19.05,52.07 0 top
R5  12.7,81.28 0 top
R6  2.54,-68.58 0 top  (outside the outline)
R7  2.54,-44.45 0 top  (outside the outline)
SPI  -7.62,-90.17 0 top  (outside the outline)
SPI_SS  -7.62,-97.79 0 top  (outside the outline)
U1  17.78,16.51 0 top
U2  12.7,67.31 0 top
U3  66.04,73.66 0 top
U4  -21.59,-92.71 0 top  (outside the outline)
UART  109.22,38.1 0 top
VCC-3V3  78.74,20.32 0 top
VCC-5V  97.79,7.62 0 top
VCC-12V  62.23,8.89 0 top
X1  151.13,67.31 90 top
X2  132.08,67.31 90 top
X3  41.91,13.97 90 top
X4  -19.05,-142.24 0 top  (outside the outline)
X5  -19.05,-160.02 0 top  (outside the outline)

### Tracks (layer width: path | path; a pad name or v marks a point on that pad's centre or on a via)
+3V3  (20 unrouted)
  Top 0.254: 9DOF.1 148.59,33.02 148.59,77.47 X1.29 | VCC-3V3.2 VCC-3V3.4
  Bottom 0.254: X2.29 132.08,80.01 148.59,80.01 X1.29 | VCC-3V3.2 73.66,25.4 | 73.66,25.4 71.12,27.94 8.89,27.94 6.35,25.4 U1.1 | 9DOF.1 140.97,25.4 73.66,25.4
+5V  (via drill 0.61)
  Top 0.254: JP1.2 109.22,63.5 v109.22,55.88 109.22,44.45 | UART.4 109.22,44.45 | JP2.2 105.41,26.67 105.41,40.64 109.22,44.45 | VCC-5V.4 VCC-5V.2
  Bottom 0.254: X1.11 148.59,57.15 132.08,57.15 X2.11 v109.22,55.88 | VCC-5V.4 99.06,20.32 JP2.2
+12V  (via drill 0.61)
  Top 0.254: 22.86,55.88 20.32,53.34 20.32,52.07 | 22.86,55.88 24.13,57.15 C4.1 | 20.32,52.07 19.05,50.8 19.05,41.91 C5.+ | 20.32,52.07 R4.2 | 34.29,85.09 36.83,85.09 L1.P$2 36.83,83.82 36.83,68.58 38.1,67.31 v38.1,46.99 29.21,46.99 29.21,49.53 22.86,55.88 | v38.1,29.21 59.56,7.75 VCC-12V.1
  Bottom 0.254: v38.1,46.99 v38.1,29.21
C_CLOCKOUT  (1 unrouted)
C_DATA0  (1 unrouted)
C_DATA1  (1 unrouted)
C_DATA2  (1 unrouted)
C_DATA3  (1 unrouted)
C_DATA4  (1 unrouted)
C_DATA5  (1 unrouted)
C_DATA6  (1 unrouted)
C_DATA7  (1 unrouted)
C_DIR  (1 unrouted)
C_NXT  (1 unrouted)
C_STP  (1 unrouted)
GND  (via drill 0.61)  (41 unrouted)
  Top 0.254: 11.43,87 11.43,92.71 15.75,92.71 16.26,93.22 40.13,93.22 40.64,92.71 40.64,58.42 | 11.43,87 11.43,81.28 R5.1 | 40.64,58.42 41.91,57.15 41.91,44.45 | 40.64,58.42 39.37,59.69 C1.2 | 41.91,44.45 43.18,43.18 46.99,43.18 46.99,45.72 D1.A 88.9,45.72 88.9,19.05 | 41.91,44.45 41.91,41.91 C5.- 21.59,41.91 21.59,7.62 6.35,7.62 U1.10 | UART.1 107.95,35.56 107.95,20.32 107.95,19.05 95.38,19.05 | 95.38,19.05 88.9,19.05 | 88.9,19.05 VCC-3V3.3 VCC-3V3.1 77.47,7.75 BATTERY.1 77.34,7.62 64.77,7.62 VCC-12V.2 | X1.12 151.13,54.61 151.13,33.02 9DOF.2 | v14.35,66.67 13.72,66.04 13.72,65.28 U2.4 | v12.83,87 11.43,87 | VCC-5V.3 VCC-5V.1 96.52,7.24 95.38,8.38 95.38,19.05
  Bottom 0.254: X2.12 134.62,54.61 151.13,54.61 X1.12 151.13,57.15 151.13,77.47 | X2.30 134.62,77.47 151.13,77.47 | X1.30 151.13,77.47 | 137.16,19.05 9DOF.2 | v14.35,66.67 14.35,67.06 12.83,68.58 v12.83,87 12.83,93.98
I2C-0-SCL  (via drill 0.61)
  Top 0.254: v130.81,35.56 X2.1 | 9DOF.4 I2C0.2
  Bottom 0.254: v130.81,35.56 134.62,31.75 149.86,31.75 9DOF.4
I2C-0-SDA  (via drill 0.61)
  Top 0.254: v133.35,36.83 X2.2
  Bottom 0.254: v133.35,36.83 137.16,33.02 151.13,33.02 153.67,30.48 153.67,26.67 | 153.67,26.67 152.4,26.67 9DOF.3 | 153.67,26.67 I2C0.1
I2C-1-SCL  (1 unrouted)
I2C-1-SDA  (1 unrouted)
N$1  (2 unrouted)
N$2  (1 unrouted)
N$3  (via drill 0.61)
  Top 0.254: v12.45,63.75 12.45,65.15 U2.2 | v38.86,67.69 38.86,69.34 38.35,69.85 R1.2
  Bottom 0.254: v12.45,63.75 34.92,63.75 v38.86,67.69
N$4  (via drill 0.61)
  Top 0.254: v14.35,72.77 12.45,70.87 12.45,69.47 U2.7 | v17.02,72.77 C2.2
  Bottom 0.254: v17.02,72.77 v14.35,72.77
N$5
  Top 0.254: 5.08,65.15 5.08,39.37 19.05,39.37 20.32,40.64 20.32,48.26 C3.1 27.94,48.26 | 5.08,66.04 R2.1 5.08,65.15 | 5.08,65.15 11.68,65.15 U2.1
N$6  (via drill 0.61)
  Top 0.254: 35.56,59.69 R3.2 31.75,59.69 31.75,49.53 30.48,48.26 C3.2 31.24,48.9 v32.13,48.01 | 35.56,59.69 C1.1 36.83,59.69 | 35.56,59.69 35.56,69.85 | 16.51,92.71 16.51,88.9 | 16.51,88.9 16.51,86.36 | 16.51,86.36 16.51,74.93 C2.1 | 8.83,72.33 12.7,76.2 12.7,82.55 16.51,86.36 | 8.83,72.33 5.08,68.58 R2.2 | 16.51,88.9 35.56,69.85 | 35.56,69.85 R1.1 | 8.83,72.33 11.68,69.47 U2.8 | v36.83,33.66 64.26,6.22 77.98,6.22 79.38,7.62 82.42,7.62 BATTERY.2
  Bottom 0.254: v36.83,33.66 36.83,43.31 v32.13,48.01
N$7  (via drill 0.61)
  Top 0.254: v14.35,68.33 13.72,68.96 13.72,69.34 U2.5 | 23.37,67.31 24,66.67 Q1.3 | 23.37,67.31 v22.35,68.33 | 23.37,67.31 23.56,67.5 | 23.56,67.5 24,67.94 Q1.2 24.13,67.94 24.13,69.22 Q1.1 | 23.56,67.5 25.27,65.79 25.27,65.66 28.96,61.98 28.96,59.69 R3.1
  Bottom 0.254: v22.35,68.33 v14.35,68.33
N$8
  Top 0.254: 17.78,58.42 25.4,58.42 26.67,57.15 C4.2 | 17.78,58.42 17.78,52.07 R4.1 | 15.24,62.23 15.24,60.96 17.78,58.42 | 15.24,62.23 15.24,80.01 13.97,81.28 R5.2 | 15.24,62.23 13.08,64.39 13.08,65.15 U2.3
N$9  (via drill 0.61)
  Top 0.254: v13.72,70.87 13.08,70.23 13.08,69.47 U2.6 | v18.29,70.87 23.75,65.41 Q1.4
  Bottom 0.254: v18.29,70.87 v13.72,70.87
N$10  (via drill 0.61)  (4 unrouted)
  Top 0.254: D1.C 44.45,45.72 49.53,50.8 v49.53,68.58 49.53,83.82 L1.P$1
  Bottom 0.254: Q1.D3 Q1.D2 Q1.D1 v49.53,68.58
N$11  (8 unrouted)
N$12  (8 unrouted)
N$13  (1 unrouted)
N$14  (1 unrouted)
N$15  (3 unrouted)
N$16  (1 unrouted)
N$18  (2 unrouted)
N$21  (2 unrouted)
N$23
  Bottom 0.254: X3.11 36.83,26.67 27.94,26.67 19.05,17.78 6.35,17.78 U1.5
N$24
  Top 0.254: X3.12 41.91,19.05 41.91,8.89 38.1,8.89 33.02,13.97 29.21,13.97 U1.14
N$25
  Bottom 0.254: X3.10 36.83,17.78 29.21,25.4 U1.20
N$26
  Top 0.254: X3.8 32.38,23.5 28.83,23.5 U1.19
N$27
  Top 0.254: X3.6 40.64,11.43 39.37,11.43 29.21,21.59 U1.18
N$28
  Top 0.254: X3.4 38.1,10.16 29.21,19.05 U1.17
N$29
  Top 0.254: X3.2 29.21,7.62 U1.11
N$30
  Top 0.254: X3.1 43.18,6.35 27.94,6.35 26.67,7.62 26.67,15.24 29.21,15.24 U1.15
N$31  (via drill 0.61)
  Top 0.254: v5.71,5.46 5.71,7.87 6.73,8.89 6.73,9.4 U1.9
  Bottom 0.254: v5.71,5.46 36.83,5.46 40.39,9.02 42.04,9.02 X3.3
N$32
  Bottom 0.254: X3.5 41.91,11.43 39.37,11.43 34.29,6.35 5.08,6.35 5.08,17.78 6.35,19.05 U1.4
N$33
  Bottom 0.254: X3.7 41.91,16.51 7.62,16.51 6.35,15.24 U1.6
N$34
  Bottom 0.254: X3.9 44.45,17.78 44.45,13.97 31.75,13.97 29.21,11.43 U1.13
PWM_INPUT1  (1 unrouted)
  Bottom 0.254: X2.13 129.54,59.69 85.09,59.69
PWM_INPUT2  (1 unrouted)
  Bottom 0.254: X2.15 129.54,62.23 85.09,62.23
PWM_INPUT3  (1 unrouted)
  Bottom 0.254: X2.17 129.54,64.77 85.09,64.77
PWM_INPUT4  (1 unrouted)
  Bottom 0.254: X2.19 129.54,67.31 85.09,67.31
PWM_INPUT5  (1 unrouted)
  Bottom 0.254: X2.21 129.54,69.85 85.09,69.85
PWM_INPUT6  (1 unrouted)
  Bottom 0.254: X2.23 129.54,72.39 85.09,72.39
PWM_INPUT7  (1 unrouted)
  Bottom 0.254: X2.25 129.54,74.93 85.09,74.93
PWM_INPUT8  (1 unrouted)
  Bottom 0.254: X2.27 129.54,77.47 85.09,77.47
PWM_OUTPUT1  (1 unrouted)
  Top 0.254: X2.28 132.08,74.93 110.49,74.93 110.49,25.4
PWM_OUTPUT2  (1 unrouted)
  Top 0.254: X2.26 132.08,72.39 113.03,72.39 113.03,25.4
PWM_OUTPUT3  (1 unrouted)
  Top 0.254: X2.24 132.08,69.85 116.84,69.85 116.84,26.67
PWM_OUTPUT4  (1 unrouted)
  Top 0.254: X2.22 132.08,67.31 119.38,67.31 119.38,26.67
PWM_OUTPUT5  (1 unrouted)
  Top 0.254: X2.20 132.08,64.77 120.65,64.77 120.65,25.4
PWM_OUTPUT6  (1 unrouted)
  Top 0.254: X2.18 132.08,62.23 121.92,62.23
PWM_OUTPUT7  (1 unrouted)
  Top 0.254: X2.16 132.08,59.69 124.46,59.69
PWM_OUTPUT8  (1 unrouted)
  Top 0.254: X2.14 134.62,57.15 134.62,31.75
SPI_CLK  (1 unrouted)
  Top 0.254: 111.76,81.28 X2.31
SPI_MISO  (1 unrouted)
  Bottom 0.254: X2.34 132.08,85.09 129.54,85.09
SPI_MOSI  (1 unrouted)
  Top 0.254: 116.84,83.82 X2.33
SPI_SS0  (1 unrouted)
  Bottom 0.254: X2.32 132.08,82.55 127,82.55
SPI_SS1  (1 unrouted)
SPI_SS2  (1 unrouted)
SPI_SS3  (1 unrouted)
UART_CTS
  Bottom 0.254: X2.6 134.62,46.99 134.62,38.1 110.49,38.1 UART.3
UART_RTS
  Bottom 0.254: X2.5 132.08,46.99 132.08,39.37 UART.6
UART_RX
  Bottom 0.254: X2.3 125.73,40.64 107.95,40.64 UART.2
UART_TX  (via drill 0.61)
  Top 0.254: X2.4 132.08,44.45 v132.08,36.83
  Bottom 0.254: UART.5 v132.08,36.83
XBEE-CTS  (via drill 0.61)
  Top 0.254: v24.51,13.72 24.51,22.73 v44.07,42.29 | v127.51,48.77 127.51,49.02 130.68,52.2 132.21,52.2 X2.10
  Bottom 0.254: v24.51,13.72 28.7,9.53 U1.12 | v44.07,42.29 121.03,42.29 v127.51,48.77
XBEE-RTS
  Top 0.254: X2.9 125.73,48.26 125.73,5.08 27.94,5.08 25.4,7.62 25.4,17.78 29.21,17.78 U1.16
XBEE-RX
  Bottom 0.254: X2.8 132.21,49.66 29.46,49.66 5.71,25.91 5.71,25.15 6.73,24.13 6.73,23.62 U1.2
XBEE-TX
  Bottom 0.254: X2.7 5.08,50.8 5.08,22.86 6.35,21.59 U1.3
XI  (1 unrouted)
XO  (1 unrouted)
(copper drawn outside any net)
  shapes: Bottom area x2